# Altium schematic sheet FPGA_Tester_Board_Signals.SchDoc
size B; Organization: Altium Limited; Address1: L3, 12a Rodborough Rd; Address2: Frenchs Forest; Address3: NSW; Address4: Australia 2086; DocumentNumber: 11; SheetNumber: 8; SheetTotal: 21; PageSetup: Record=PageOptions|CenterHorizontal=True|CenterVertical=True|PrintScale=0.72|XCorrection=1.00|YCorrection=1.00|PrintKind=1|BorderSize=5000000|LeftOffset=0|BottomOffset=0|Orientation=2|PaperLength=2794|PaperWidth=2159|Scale=100|PaperSource=7|PrintQuality=600|MediaType=1|DitherType=10|PrintScaleMode=1|PaperKind=Letter|PaperIndex=1
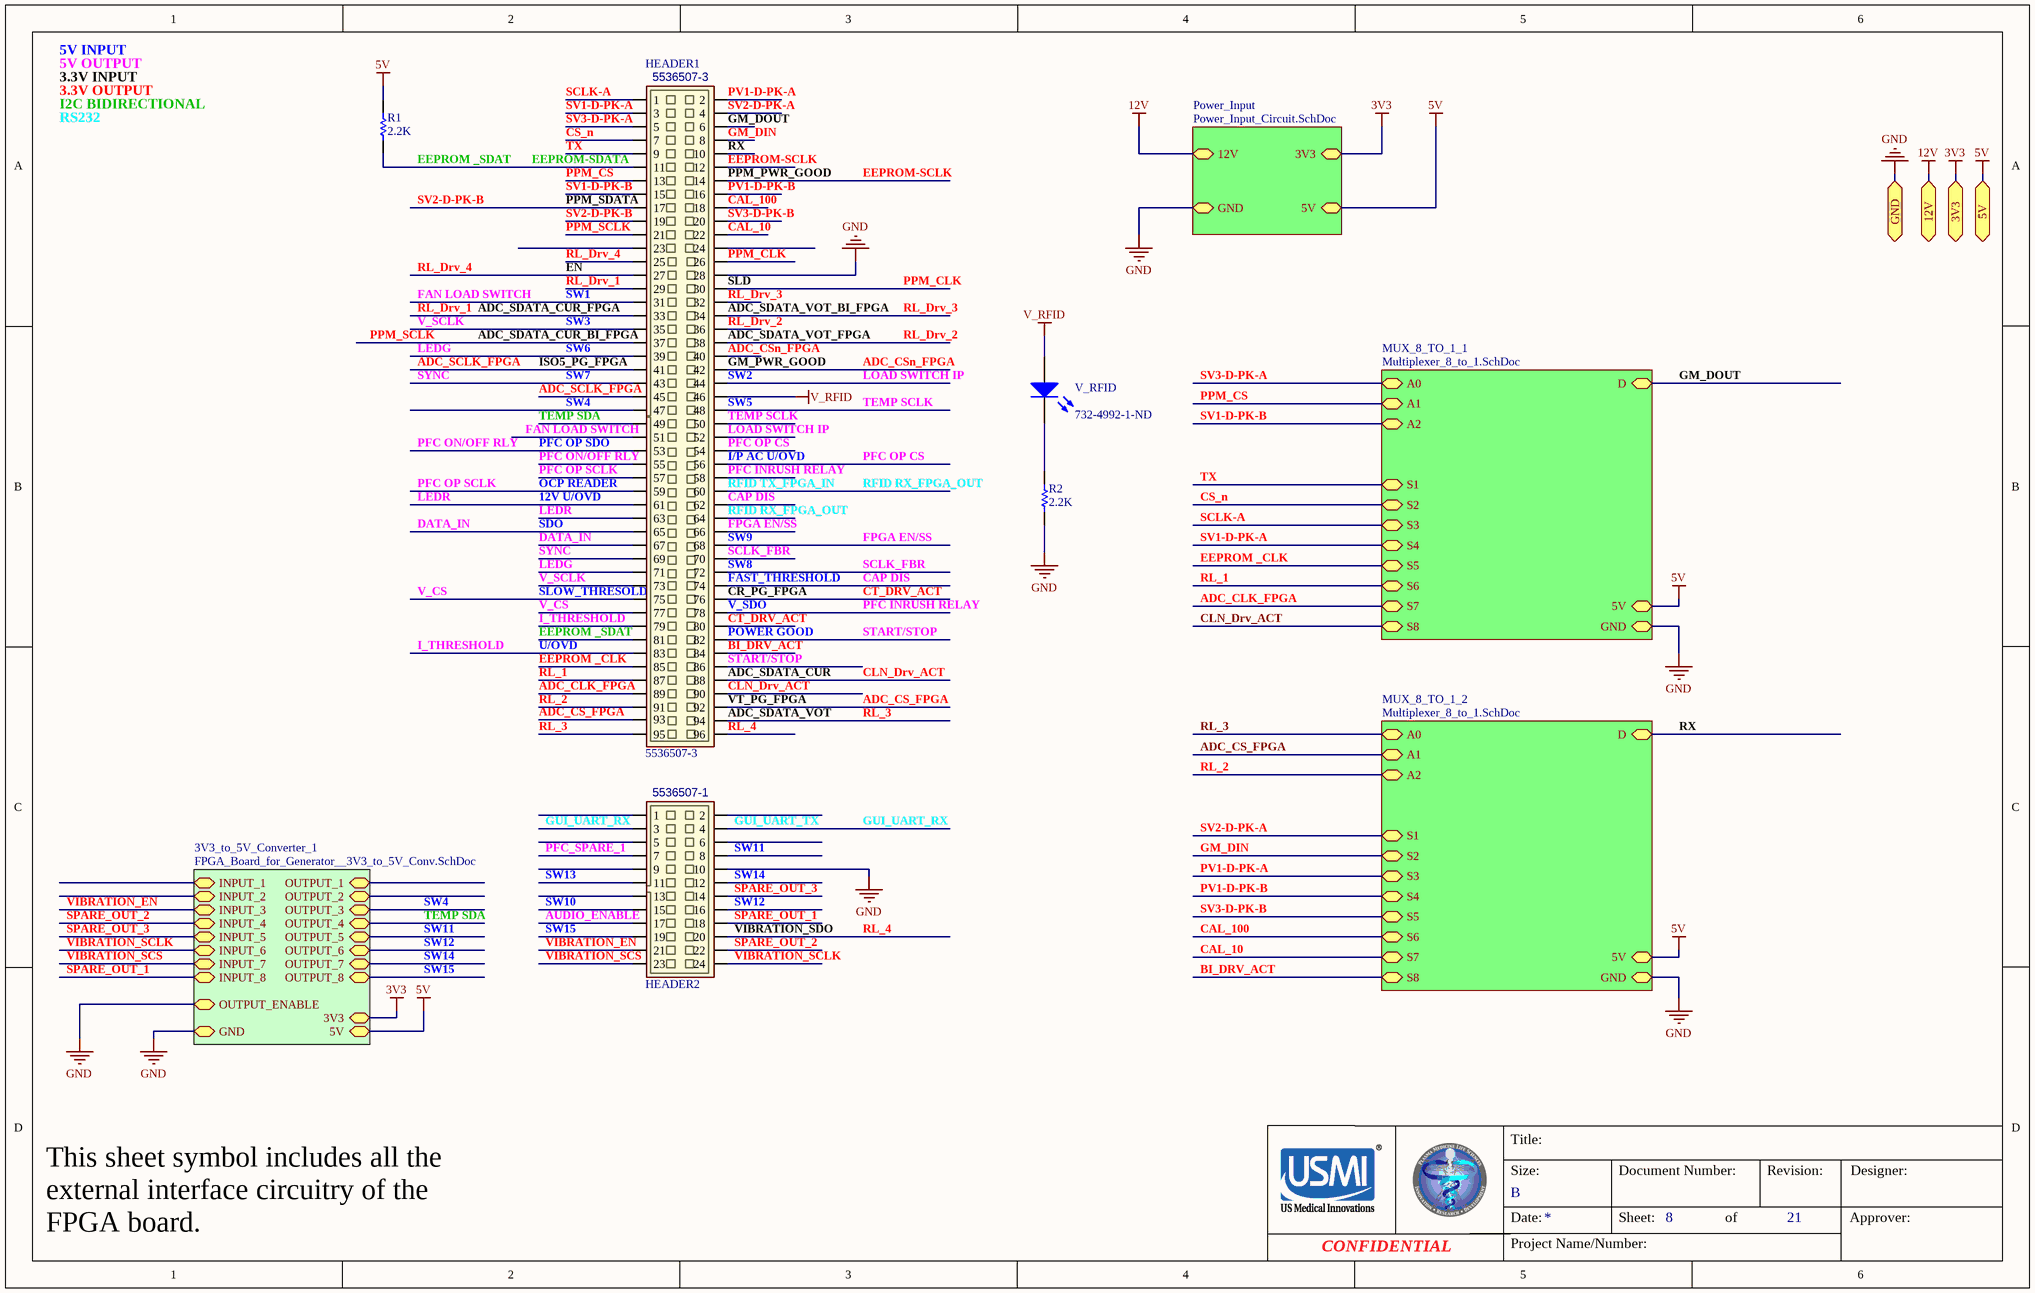
[diagram p0: FPGA_Tester_Board_Signals.SchDoc]

## Parts
HEADER1  5536507-3  [5536501-3]
HEADER2  5536507-1  [5536501-1]  (value not drawn)
R1  2.2K  [0603R]
R2  2.2K  [0603R]
V_RFID  Supplier Part Number 1: 732-4992-1-ND  [1206_A]  (hidden comment: RED)

## Sub-sheets
3V3_to_5V_Converter_1 = FPGA_Board_for_Generator__3V3_to_5V_Conv.SchDoc: INPUT_5, INPUT_7, INPUT_8, INPUT_2, INPUT_6, INPUT_4, INPUT_1, INPUT_3, OUTPUT_5, OUTPUT_4, OUTPUT_6, OUTPUT_1, OUTPUT_2, OUTPUT_3, OUTPUT_7, OUTPUT_8, OUTPUT_ENABLE, GND, 5V, 3V3
MUX_8_TO_1_1 = Multiplexer_8_to_1.SchDoc: A0, S2, S1, A1, S3, S5, GND, A2, S7, S4, S8, D, 5V, S6
MUX_8_TO_1_2 = Multiplexer_8_to_1.SchDoc: D, S2, S6, A0, S3, 5V, S8, S4, S5, S7, A1, A2, S1, GND
Power_Input = Power_Input_Circuit.SchDoc: GND, 3V3, 12V, 5V

## Ports
3V3, 5V, 12V, GND

## Nets
3V3: port 3V3, sheet 3V3_to_5V_Converter_1/3V3, sheet Power_Input/3V3
5V: R1.2 ; port 5V, sheet 3V3_to_5V_Converter_1/5V, sheet Power_Input/5V, sheet MUX_8_TO_1_1/5V, sheet MUX_8_TO_1_2/5V
12V: port 12V, sheet Power_Input/12V
GND: HEADER1.28 HEADER2.10 R2.1 ; port GND, sheet 3V3_to_5V_Converter_1/OUTPUT_ENABLE, sheet 3V3_to_5V_Converter_1/GND, sheet Power_Input/GND, sheet MUX_8_TO_1_1/GND, sheet MUX_8_TO_1_2/GND
V_RFID: HEADER1.46 V_RFID.2(A)
12V U/OVD: HEADER1.61 HEADER1.63  [also labelled LEDR]
ADC_CLK_FPGA: HEADER1.89 ; sheet MUX_8_TO_1_1/S7
ADC_CS_FPGA: HEADER1.92 HEADER1.93 ; sheet MUX_8_TO_1_2/A1  [also labelled VT_PG_FPGA]
ADC_CSn_FPGA: HEADER1.40 HEADER1.42  [also labelled GM_PWR_GOOD]
ADC_SCLK_FPGA: HEADER1.41 HEADER1.45  [also labelled ISO5_PG_FPGA]
ADC_SDATA_CUR: HEADER1.88 HEADER1.90 ; sheet MUX_8_TO_1_1/S8  [also labelled CLN_Drv_ACT]
ADC_SDATA_CUR_BI_FPGA: HEADER1.21 HEADER1.37  [also labelled PPM_SCLK]
ADC_SDATA_CUR_FPGA: HEADER1.29 HEADER1.33  [also labelled RL_Drv_1]
ADC_SDATA_VOT: HEADER1.94 HEADER1.95 ; sheet MUX_8_TO_1_2/A0  [also labelled RL_3]
ADC_SDATA_VOT_BI_FPGA: HEADER1.32 HEADER1.34  [also labelled RL_Drv_3]
ADC_SDATA_VOT_FPGA: HEADER1.36 HEADER1.38  [also labelled RL_Drv_2]
AUDIO_ENABLE: HEADER2.17
BI_DRV_ACT: HEADER1.84 ; sheet MUX_8_TO_1_2/S8
CAL_10: HEADER1.22 ; sheet MUX_8_TO_1_2/S7
CAL_100: HEADER1.18 ; sheet MUX_8_TO_1_2/S6
CAP DIS: HEADER1.62 HEADER1.74  [also labelled FAST_THRESHOLD]
CR_PG_FPGA: HEADER1.76 HEADER1.80  [also labelled CT_DRV_ACT]
CS_n: HEADER1.7 ; sheet MUX_8_TO_1_1/S2
DATA_IN: HEADER1.65 HEADER1.67  [also labelled SDO]
EEPROM _CLK: HEADER1.85 ; sheet MUX_8_TO_1_1/S5
EEPROM _SDAT: HEADER1.11 HEADER1.81 R1.1  [also labelled EEPROM-SDATA]
EEPROM-SCLK: HEADER1.12 HEADER1.14  [also labelled PPM_PWR_GOOD]
EN: HEADER1.25 HEADER1.27  [also labelled RL_Drv_4]
FAN LOAD SWITCH: HEADER1.31 HEADER1.51  [also labelled SW1]
FPGA EN/SS: HEADER1.66 HEADER1.68  [also labelled SW9]
GM_DIN: HEADER1.8 ; sheet MUX_8_TO_1_2/S2
GM_DOUT: HEADER1.6 ; sheet MUX_8_TO_1_1/D
GUI_UART_RX: HEADER2.3 HEADER2.4  [also labelled GUI_UART_TX]
I/P AC U/OVD: HEADER1.54 HEADER1.56  [also labelled PFC OP CS]
I_THRESHOLD: HEADER1.79 HEADER1.83  [also labelled U/OVD]
LEDG: HEADER1.39 HEADER1.71  [also labelled SW6]
LOAD SWITCH IP: HEADER1.44 HEADER1.52  [also labelled SW2]
OCP READER: HEADER1.57 HEADER1.59  [also labelled PFC OP SCLK]
PFC INRUSH RELAY: HEADER1.58 HEADER1.78  [also labelled V_SDO]
PFC ON/OFF RLY: HEADER1.53 HEADER1.55  [also labelled PFC OP SDO]
PFC_SPARE_1: HEADER2.7
POWER GOOD: HEADER1.82 HEADER1.86  [also labelled START/STOP]
PPM_CLK: HEADER1.26 HEADER1.30  [also labelled SLD]
PPM_CS: HEADER1.13 ; sheet MUX_8_TO_1_1/A1
PPM_SDATA: HEADER1.17 HEADER1.19  [also labelled SV2-D-PK-B]
PV1-D-PK-A: HEADER1.2 ; sheet MUX_8_TO_1_2/S3
PV1-D-PK-B: HEADER1.16 ; sheet MUX_8_TO_1_2/S4
RFID RX_FPGA_OUT: HEADER1.60 HEADER1.64  [also labelled RFID TX_FPGA_IN]
RL_1: HEADER1.87 ; sheet MUX_8_TO_1_1/S6
RL_2: HEADER1.91 ; sheet MUX_8_TO_1_2/A2
RL_4: HEADER1.96 HEADER2.20  [also labelled VIBRATION_SDO]
RX: HEADER1.10 ; sheet MUX_8_TO_1_2/D
SCLK-A: HEADER1.1 ; sheet MUX_8_TO_1_1/S3
SCLK_FBR: HEADER1.70 HEADER1.72  [also labelled SW8]
SLOW_THRESOLD: HEADER1.75 HEADER1.77  [also labelled V_CS]
SPARE_OUT_1: HEADER2.18 ; sheet 3V3_to_5V_Converter_1/INPUT_8
SPARE_OUT_2: HEADER2.22 ; sheet 3V3_to_5V_Converter_1/INPUT_4
SPARE_OUT_3: HEADER2.14 ; sheet 3V3_to_5V_Converter_1/INPUT_5
SV1-D-PK-A: HEADER1.3 ; sheet MUX_8_TO_1_1/S4
SV1-D-PK-B: HEADER1.15 ; sheet MUX_8_TO_1_1/A2
SV2-D-PK-A: HEADER1.4 ; sheet MUX_8_TO_1_2/S1
SV3-D-PK-A: HEADER1.5 ; sheet MUX_8_TO_1_1/A0
SV3-D-PK-B: HEADER1.20 ; sheet MUX_8_TO_1_2/S5
SW3: HEADER1.35 HEADER1.73  [also labelled V_SCLK]
SW4: HEADER1.47 ; sheet 3V3_to_5V_Converter_1/OUTPUT_3
SW5: HEADER1.48 HEADER1.50  [also labelled TEMP SCLK]
SW7: HEADER1.43 HEADER1.69  [also labelled SYNC]
SW10: HEADER2.15
SW11: HEADER2.8 ; sheet 3V3_to_5V_Converter_1/OUTPUT_5
SW12: HEADER2.16 ; sheet 3V3_to_5V_Converter_1/OUTPUT_6
SW13: HEADER2.11
SW14: HEADER2.12 ; sheet 3V3_to_5V_Converter_1/OUTPUT_7
SW15: HEADER2.19 ; sheet 3V3_to_5V_Converter_1/OUTPUT_8
TEMP SDA: HEADER1.49 ; sheet 3V3_to_5V_Converter_1/OUTPUT_4
TX: HEADER1.9 ; sheet MUX_8_TO_1_1/S1
VIBRATION_EN: HEADER2.21 ; sheet 3V3_to_5V_Converter_1/INPUT_3
VIBRATION_SCLK: HEADER2.24 ; sheet 3V3_to_5V_Converter_1/INPUT_6
VIBRATION_SCS: HEADER2.23 ; sheet 3V3_to_5V_Converter_1/INPUT_7
NetR2_2: R2.2 V_RFID.1(K)

Not connected (* = marked no-connect by the designer): HEADER1 23 24; HEADER2 1 2 5 6 9 13

## Notes on the sheet
- 5V INPUT
- 5V OUTPUT
- 3.3V INPUT
- 3.3V OUTPUT
- I2C BIDIRECTIONAL
- RS232
- Title:
- Size:
- Document Number:
- Revision:
- Designer:
- This sheet symbol includes all the external interface circuitry of the FPGA board.
- Date:
- Project Name/Number:
- B
- Sheet:
- of
- Approver:
- CONFIDENTIAL

## Library data of the parts
HEADER1 = 5536507-3: TE Z-Pack 5536507-3; Supplier 1: Digi-Key; Supplier 2: Mouser; Supplier Part Number 2: 571-5536507-3; Supplier Part Number 1: A31557-ND
HEADER2 = 5536507-1: TE Z-Pack 5536507-1; Supplier 1: Digi-Key; Supplier 2: Mouser; Supplier Part Number 1: A31555-ND; Supplier Part Number 2: 571-5536507-1
R1 R2 = Res1: Resistor; Published: 8-Jun-2000; LatestRevisionDate: 17-Jul-2002; LatestRevisionNote: Re-released for DXP Platform.; PackageReference: AXIAL-0.3; Publisher: Altium Limited; PackageDescription: Axial Device, Thru-Hole; 2 Leads; 0.3 in Pin Spacing; Value: 2.2K; Supplier 1: Digi-Key; Supplier Part Number 1: 311-2.20KHRCT-ND
V_RFID = CMP-1426-00017-1: SMD mono-color Chip LED, WL-SMCW, Super Red; Manufacturer: Wuerth Elektronik; PartNumber: 150120SS75000; ComponentLink1URL: http://www.we-online.com; PackageReference: 1206_A; ComponentLink2Description: Datasheet; ComponentLink1Description: Manufacturer URL; ComponentLink2URL: http://katalog.we-online.com/led/datasheet/150120SS75000.pdf; Color: Super Red; Supplier 1: Digi-Key